# EAGLE design AriqTraining (EAGLE 9.6.2)
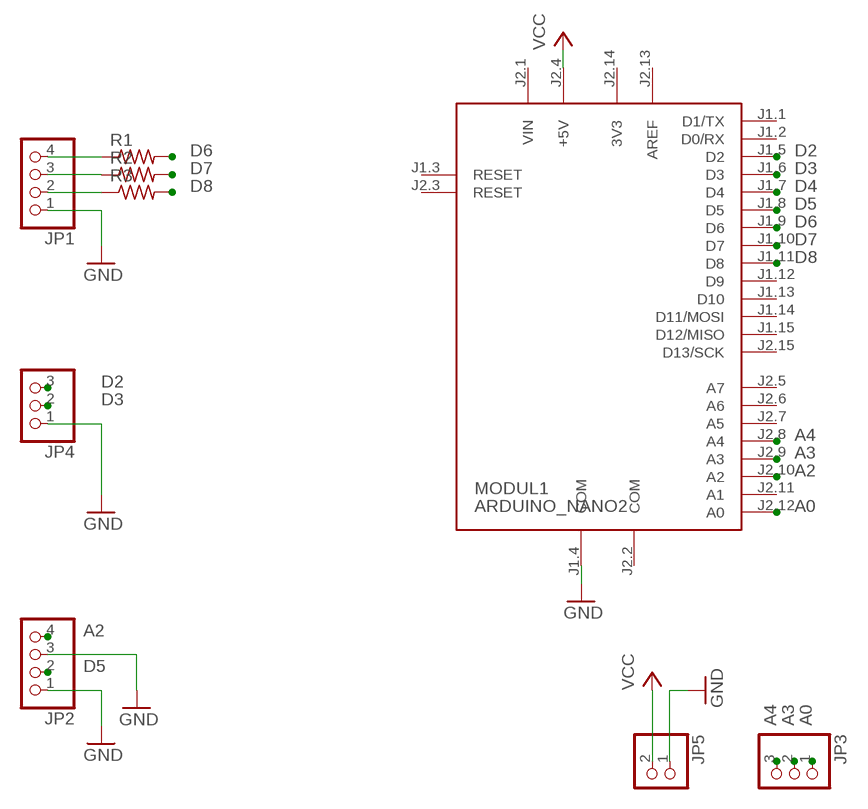
[diagram p0: schematic, sheet 1]

## Parts
JP1  PINHD-1X4  [1X04]
JP2  PINHD-1X4  [1X04]
JP3  PINHD-1X3  [1X03]
JP4  PINHD-1X3  [1X03]
JP5  PINHD-1X2  [1X02]
MODUL1  ARDUINO_NANO2  [ARDUINO_NANO2]
R1  R-US_0207/10  [0207/10]
R2  R-US_0207/10  [0207/10]
R3  R-US_0207/10  [0207/10]

## Nets
A0: JP3.1 MODUL1.J2.12(A0)
A2: JP2.4 MODUL1.J2.10(A2)
A3: JP3.2 MODUL1.J2.9(A3)
A4: JP3.3 MODUL1.J2.8(A4)
D2: JP4.3 MODUL1.J1.5(D2)
D3: JP4.2 MODUL1.J1.6(D3)
D4: MODUL1.J1.7(D4)
D5: JP2.2 MODUL1.J1.8(D5)
D6: MODUL1.J1.9(D6) R1.2
D7: MODUL1.J1.10(D7) R2.2
D8: MODUL1.J1.11(D8) R3.2
GND: JP1.1 JP2.1 JP2.3 JP4.1 JP5.1 MODUL1.J1.4(COM)
N$2: JP1.4 R1.1
N$3: JP1.3 R2.1
N$4: JP1.2 R3.1
VCC: JP5.2 MODUL1.J2.4(+5V)
Unconnected: MODUL1.J1.1(D1/TX) MODUL1.J1.2(D0/RX) MODUL1.J1.3(RESET) MODUL1.J1.12(D9) MODUL1.J1.13(D10) MODUL1.J1.14(D11/MOSI) MODUL1.J1.15(D12/MISO) MODUL1.J2.3(RESET) MODUL1.J2.5(A7) MODUL1.J2.6(A6) MODUL1.J2.7(A5) MODUL1.J2.11(A1) MODUL1.J2.15(D13/SCK)

## Power pins joined to a net without a drawn wire
3V3: MODUL1.J2.14(3V3)
AREF: MODUL1.J2.13(AREF)
COM: MODUL1.J2.2(COM)
VIN: MODUL1.J2.1(VIN)

## Library data of the parts
JP1 JP2 = pinhead:PINHD-1X4: PIN HEADER
JP3 JP4 = pinhead:PINHD-1X3: PIN HEADER
JP5 = pinhead:PINHD-1X2: PIN HEADER
MODUL1 = arduino:ARDUINO_NANO2: Arduino Nano2 Auto generated by modulcreator.ulp \;; ANZAHL: 2; MODUL: TRUE; STECKX0: -76200; STECKX1: 76200; STECKY0: 177800; STECKY1: 177800
R1-R3 = rcl:R-US_: RESISTOR, American symbol; SPICEPREFIX: R

## Board
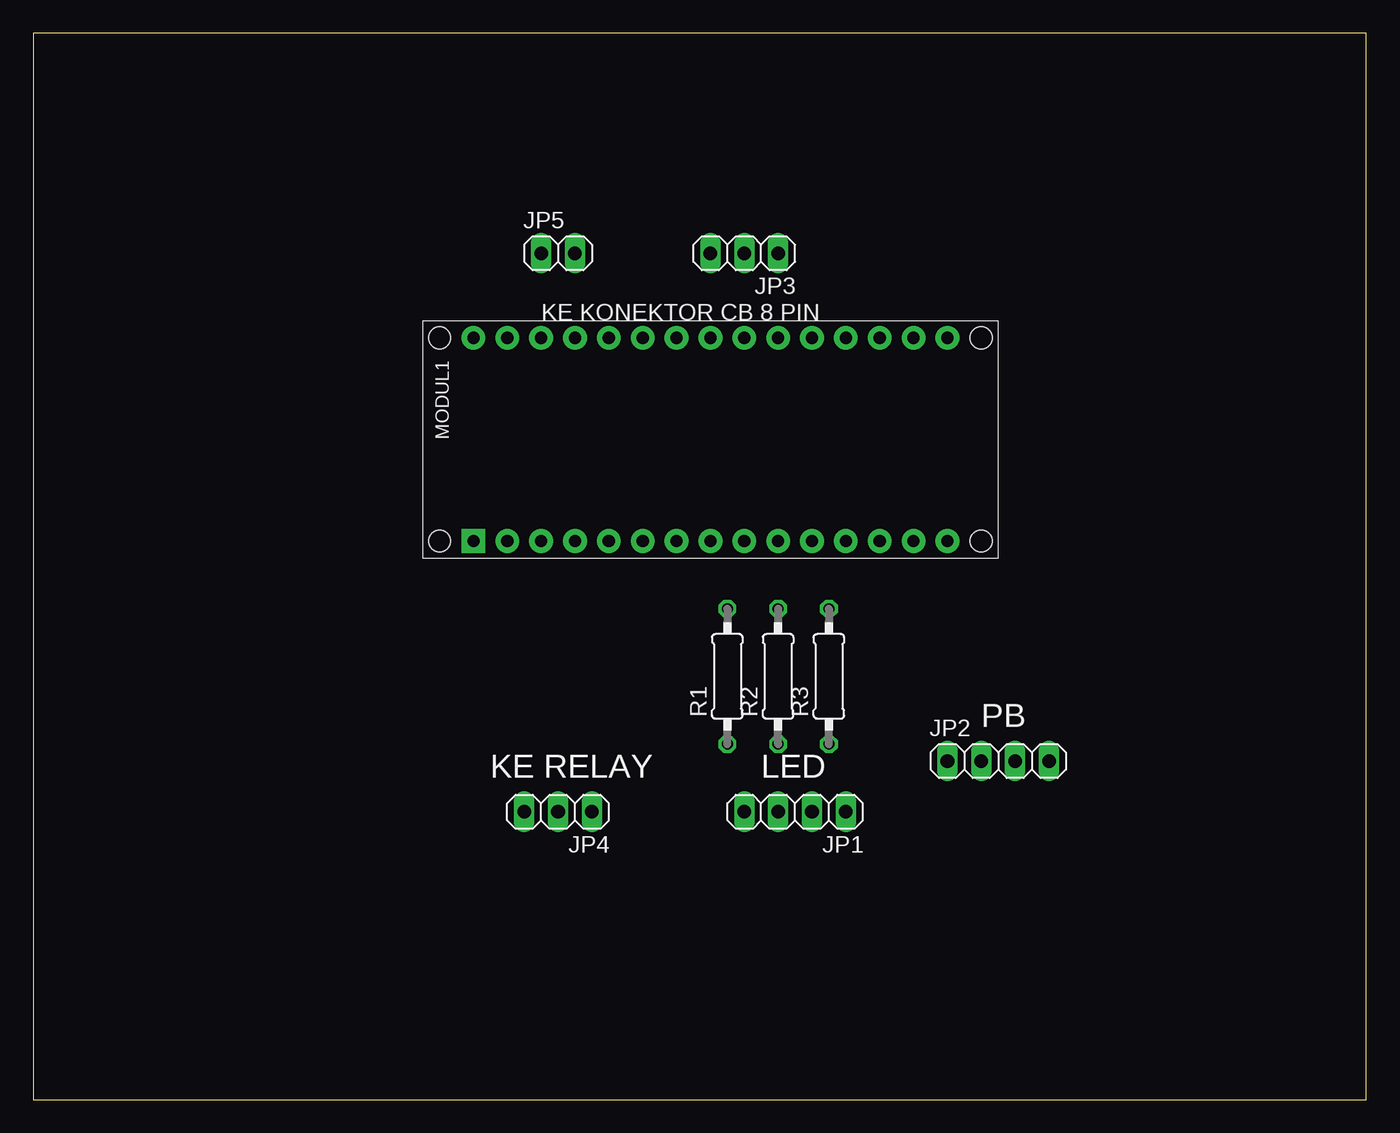
[diagram p1: board, top side]
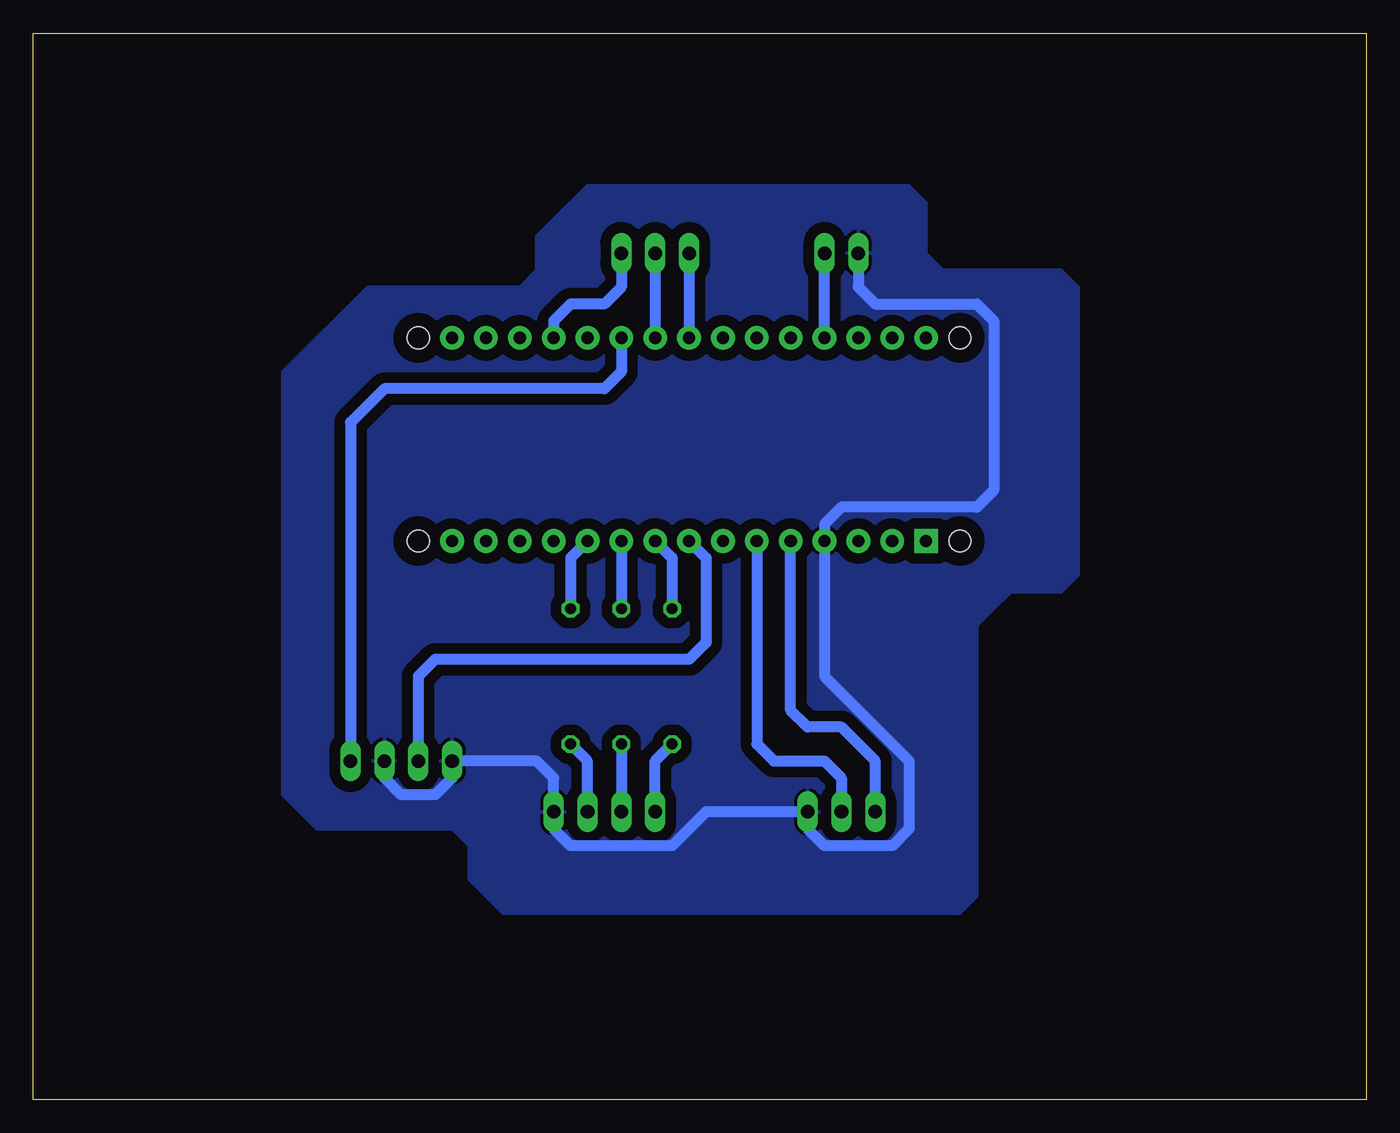
[diagram p2: board, bottom side, seen from below]

Size 100 x 80 mm. Coordinates in mm from the lower left corner, seen from the top.
Outline: 0,0 100,0 100,80 0,80 0,0
Copper layers (1*16): Top 0.035mm / dielectric 1.5mm / Bottom 0.035mm
Design rules "default": minimum track width 6mil, minimum drill 0.35mm, track to track 6mil, track to pad 6mil, pad to pad 6mil, via to via 6mil, smd to smd 6mil, copper to edge 40mil, drill to drill 6mil, minimum pad ring 10mil, minimum via ring 8mil, stop-mask expansion 4mil, vias tented up to drill 0mil, thermal gap 10mil

### Footprints (pad centres in the part's own frame; a part is rotated, then mirrored left to right if it is on the bottom)
1X04 = drill 1.016 long: 1 -3.81,0; 2 -1.27,0; 3 1.27,0; 4 3.81,0
1X03 = drill 1.016 long: 1 -2.54,0; 2 0,0; 3 2.54,0
1X02 = drill 1.016 long: 1 -1.27,0; 2 1.27,0
ARDUINO_NANO2 = drill 0.914 pad 1.778 square: J1.1 -7.62,17.78 | drill 0.914 pad 1.778: J1.2 -7.62,15.24; J1.3 -7.62,12.7; J1.4 -7.62,10.16; J1.5 -7.62,7.62; J1.6 -7.62,5.08; J1.7 -7.62,2.54; J1.8 -7.62,0; J1.9 -7.62,-2.54; J1.10 -7.62,-5.08; J1.11 -7.62,-7.62; J1.12 -7.62,-10.16; J1.13 -7.62,-12.7; J1.14 -7.62,-15.24; J1.15 -7.62,-17.78; J2.1 7.62,17.78; J2.2 7.62,15.24; J2.3 7.62,12.7; J2.4 7.62,10.16; J2.5 7.62,7.62; J2.6 7.62,5.08; J2.7 7.62,2.54; J2.8 7.62,0; J2.9 7.62,-2.54; J2.10 7.62,-5.08; J2.11 7.62,-7.62; J2.12 7.62,-10.16; J2.13 7.62,-12.7; J2.14 7.62,-15.24; J2.15 7.62,-17.78 | hole 1.651: -7.62,-20.32; 7.62,-20.32; 7.62,20.32; -7.62,20.32
0207/10 = drill 0.813 octagon: 1 -5.08,0; 2 5.08,0

### Placement (x,y rotation side)
JP1  57.15,21.59 180 top
JP2  72.39,25.4 0 top
JP3  53.34,63.5 180 top
JP4  39.37,21.59 180 top
JP5  39.37,63.5 0 top
MODUL1  50.8,49.53 90 top
R1  52.07,31.75 90 top
R2  55.88,31.75 90 top
R3  59.69,31.75 90 top

### Tracks (layer width: path | path; a pad name or v marks a point on that pad's centre or on a via)
A0
  Bottom 0.813: JP3.1 55.88,60.96 57.15,59.69 59.69,59.69 60.96,58.42 MODUL1.J2.12
A2
  Bottom 0.813: MODUL1.J2.10 55.88,54.61 57.15,53.34 73.66,53.34 76.2,50.8 JP2.4
A3
  Bottom 0.813: JP3.2 MODUL1.J2.9
A4
  Bottom 0.813: JP3.3 MODUL1.J2.8
D2
  Bottom 0.813: JP4.3 36.83,25.4 39.37,27.94 41.91,27.94 43.18,29.21 MODUL1.J1.5
D3
  Bottom 0.813: MODUL1.J1.6 45.72,26.67 44.45,25.4 40.64,25.4 39.37,24.13 JP4.2
D5
  Bottom 0.813: MODUL1.J1.8 49.53,40.64 49.53,34.29 50.8,33.02 69.85,33.02 71.12,31.75 JP2.2
D6
  Bottom 0.813: MODUL1.J1.9 52.07,40.64 R1.2
D7
  Bottom 0.813: MODUL1.J1.10 R2.2
D8
  Bottom 0.813: MODUL1.J1.11 59.69,40.64 R3.2
GND
  Bottom 0.813: JP2.3 73.66,24.13 72.39,22.86 69.85,22.86 68.58,24.13 JP2.1 62.23,25.4 60.96,24.13 JP1.1 60.96,20.32 59.69,19.05 52.07,19.05 49.53,21.59 JP4.1 41.91,20.32 40.64,19.05 35.56,19.05 34.29,20.32 34.29,25.4 40.64,31.75 MODUL1.J1.4 40.64,43.18 39.37,44.45 29.21,44.45 27.94,45.72 27.94,58.42 29.21,59.69 36.83,59.69 38.1,60.96 JP5.1
  pour Bottom (isolate 0.813): 45.72,68.58 58.42,68.58 60.96,66.04 62.23,64.77 62.23,62.23 63.5,60.96 74.93,60.96 81.28,54.61 81.28,22.86 78.74,20.32 76.2,20.32 68.58,20.32 67.31,19.05 67.31,16.51 66.04,15.24 64.77,13.97 30.48,13.97 29.21,15.24 29.21,34.29 29.21,35.56 27.94,36.83 26.67,38.1 22.86,38.1 21.59,39.37 21.59,60.96 22.86,62.23 31.75,62.23 33.02,63.5 33.02,67.31 34.29,68.58
N$2
  Bottom 0.813: JP1.4 53.34,25.4 R1.1
N$3
  Bottom 0.813: R2.1 JP1.3
N$4
  Bottom 0.813: R3.1 58.42,25.4 JP1.2
VCC
  Bottom 0.813: MODUL1.J2.4 JP5.2

### Text on the board
tNames: KE KONEKTOR CB 8 PIN | PB | KE RELAY | LED